# EAGLE design keyfob (EAGLE 5.11)
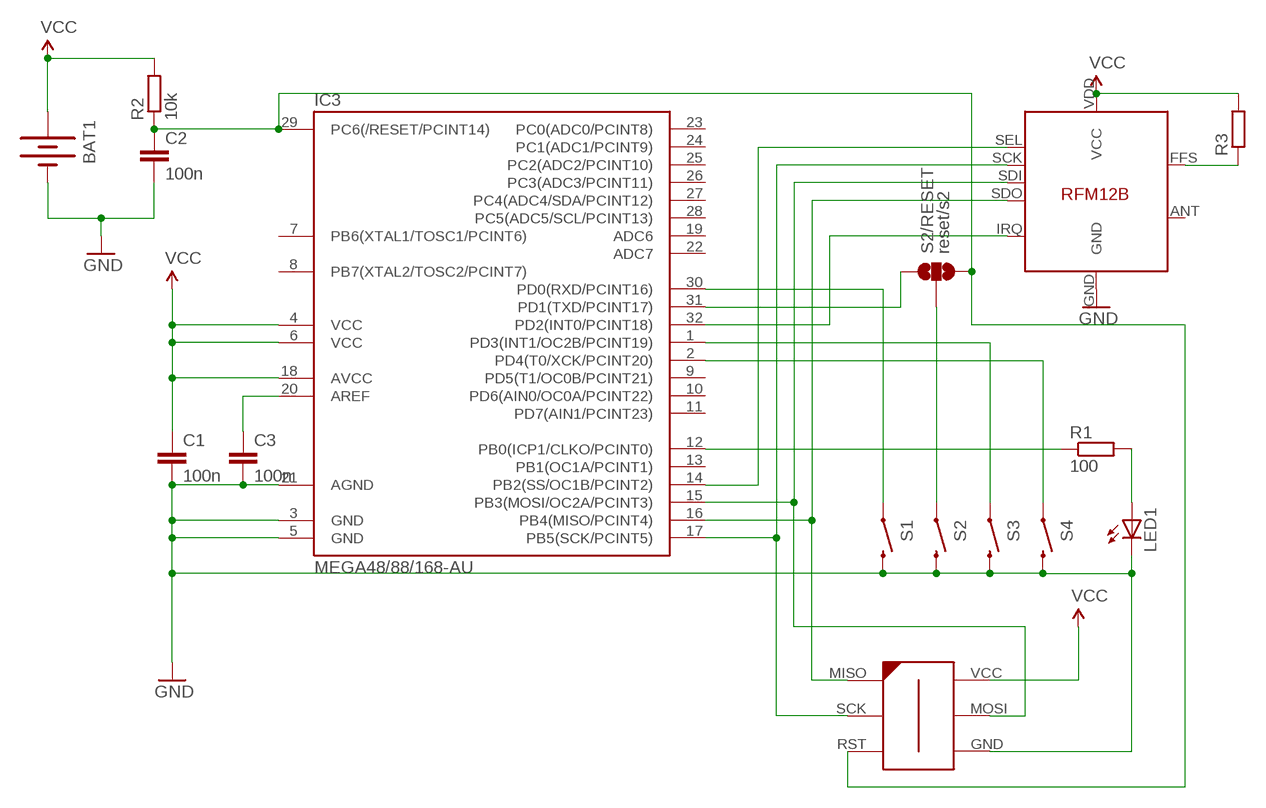
[diagram p0: schematic, sheet 1]

## Parts
BAT1  BATTERYFOB  [BATTERY_20MM_PTH_COMPACT]
C1  100n  CAP0805  [0805]
C2  100n  CAP0805  [0805]
C3  100n  CAP0805  [0805]
IC2  RFM12B  [RFM12B]
IC3  MEGA48/88/168-AU  [TQFP32-08]
LED1  LEDCHIP-LED0805  [CHIP-LED0805]
R1  100  R-EU_M0805  [M0805]
R2  10k  R-EU_M0805  [M0805]
R3  R-EU_M0805  [M0805]
S1  SWITCH-MOMENTARY-2-SMD-1101NE  [TACTILE-SWITCH-1101NE]
S2  SWITCH-MOMENTARY-2-SMD-1101NE  [TACTILE-SWITCH-1101NE]
S2/RESET  reset/s2  SOLDERJUMPER_2WAYT  [SJ_2]
S3  SWITCH-MOMENTARY-2-SMD-1101NE  [TACTILE-SWITCH-1101NE]
S4  SWITCH-MOMENTARY-2-SMD-1101NE  [TACTILE-SWITCH-1101NE]
U$1  AVR-ISP-6-EDGE  [6PAD_ISP]

## Nets
GND: BAT1.2(-) C1.2 C2.2 C3.2 IC2.GND IC3.3(GND) IC3.5(GND) IC3.21(AGND) LED1.C S1.P$2 S2.P$2 S3.P$2 S4.P$2 U$1.GND
MISO: IC2.SDO IC3.16(PB4(MISO/PCINT4)) U$1.MISO
MOSI: IC2.SDI IC3.15(PB3(MOSI/OC2A/PCINT3)) U$1.MOSI
N$1: LED1.A R1.2
N$2: S2.P$1 S2/RESET.2
N$3: C3.1 IC3.20(AREF)
N$4: IC2.IRQ IC3.32(PD2(INT0/PCINT18))
N$5: IC3.30(PD0(RXD/PCINT16)) S1.P$1
N$6: IC3.31(PD1(TXD/PCINT17)) S2/RESET.1
N$7: IC3.1(PD3(INT1/OC2B/PCINT19)) S3.P$1
N$8: IC3.2(PD4(T0/XCK/PCINT20)) S4.P$1
N$9: IC3.12(PB0(ICP1/CLKO/PCINT0)) R1.1
N$14: IC2.FFS R3.1
RESET: C2.1 IC3.29(PC6(/RESET/PCINT14)) R2.1 S2/RESET.3 U$1.RST
SCK: IC2.SCK IC3.17(PB5(SCK/PCINT5)) U$1.SCK
SEL: IC2.SEL IC3.14(PB2(SS/OC1B/PCINT2))
VCC: BAT1.1(+) C1.1 IC2.VDD(VCC) IC3.4(VCC) IC3.6(VCC) IC3.18(AVCC) R2.2 R3.2 U$1.VCC
Unconnected: IC2.ANT IC3.7(PB6(XTAL1/TOSC1/PCINT6)) IC3.8(PB7(XTAL2/TOSC2/PCINT7)) IC3.9(PD5(T1/OC0B/PCINT21)) IC3.10(PD6(AIN0/OC0A/PCINT22)) IC3.11(PD7(AIN1/PCINT23)) IC3.13(PB1(OC1A/PCINT1)) IC3.19(ADC6) IC3.22(ADC7) IC3.23(PC0(ADC0/PCINT8)) IC3.24(PC1(ADC1/PCINT9)) IC3.25(PC2(ADC2/PCINT10)) IC3.26(PC3(ADC3/PCINT11)) IC3.27(PC4(ADC4/SDA/PCINT12)) IC3.28(PC5(ADC5/SCL/PCINT13))

## Library data of the parts
BAT1 = SparkFun:BATTERY: Battery Holders Various common sizes : AA, AAA, 20mm coin cell and 12mm coin cell.
C1-C3 = SparkFun:CAP: Capacitor Standard 0603 ceramic capacitor, and 0.1" leaded capacitor.
IC2 = JeeParts:RFM12B
IC3 = avr-7:MEGA48/88/168
LED1 = led:LED: LED OSRAM: - CHIPLED LG R971, LG N971, LY N971, LG Q971, LY Q971, LO R971, LY R971 LH N974, LH R974 LS Q976, LO Q976, LY Q976 LO Q996 - Hyper CHIPLED LW Q18S LB Q993, LB Q99A, LB R99A - SideLED LS A670, LO A670, LY A670, LG A670, LP A670 LB A673, LV A673, LT A673, LW A673 LH A674 LY A675 LS A676, LA A676, LO A676, LY A676, LW A676 LS A679, LY A679, LG A679 - Hyper Micro SIDELED® LS Y876, LA Y876, LO Y876, LY Y876 LT Y87S - SmartLED LW L88C, LW L88S LB L89C, LB L89S, LG L890 LS L89K, LO L89K, LY L89K LS L896, LA L896, LO L896, LY L896 - TOPLED LS T670, LO T670, LY T670, LG T670, LP T670 LSG T670, LSP T670, LSY T670, LOP T670, LYG T670 LG T671, LOG T671, LSG T671 LB T673, LV T673, LT T673, LW T673 LH T674 LS T676, LA T676, LO T676, LY T676, LB T676, LH T676, LSB T676, LW T676 LB T67C, LV T67C, LT T67C, LS T67K, LO T67K, LY T67K, LW E67C LS E67B, LA E67B, LO E67B, LY E67B, LB E67C, LV E67C, LT E67C LW T67C LS T679, LY T679, LG T679 LS T770, LO T770, LY T770, LG T770, LP T770 LB T773, LV T773, LT T773, LW T773 LH T774 LS E675, LA E675, LY E675, LS T675 LS T776, LA T776, LO T776, LY T776, LB T776 LHGB T686 LT T68C, LB T68C - Hyper Mini TOPLED® LB M676 - Mini TOPLED Santana® LG M470 LS M47K, LO M47K, LY M47K Source: http://www.osram.convergy.de LUXEON: - LUMILED® LXK2-PW12-R00, LXK2-PW12-S00, LXK2-PW14-U00, LXK2-PW14-V00 LXK2-PM12-R00, LXK2-PM12-S00, LXK2-PM14-U00 LXK2-PE12-Q00, LXK2-PE12-R00, LXK2-PE12-S00, LXK2-PE14-T00, LXK2-PE14-U00 LXK2-PB12-K00, LXK2-PB12-L00, LXK2-PB12-M00, LXK2-PB14-N00, LXK2-PB14-P00, LXK2-PB14-Q00 LXK2-PR12-L00, LXK2-PR12-M00, LXK2-PR14-Q00, LXK2-PR14-R00 LXK2-PD12-Q00, LXK2-PD12-R00, LXK2-PD12-S00 LXK2-PH12-R00, LXK2-PH12-S00 LXK2-PL12-P00, LXK2-PL12-Q00, LXK2-PL12-R00 Source: www.luxeon.com KINGBRIGHT: KA-3528ASYC Source: www.kingbright.com
R1-R3 = rcl:R-EU_: RESISTOR, European symbol
S1-S4 = SparkFun:SWITCH-MOMENTARY-2
S2/RESET = SparkFun:SOLDERJUMPER_2WAY: Solder Jumper 2 way solder jumper
U$1 = avr-7:AVR-ISP-6-EDGE: 6 pin edge connector for ISP with ATMEL MCUs. Developed by Craig Moates (craig at moates dot net). Library by David Blundell (blundar at gmail dot com). Often, even a 6 pin header is really inconvenient for board layout and/or production. This SMD-only header is our de-facto standard for using an edge connector for programming with the help of a 6pin/10pin to edge card adapter.

## Board
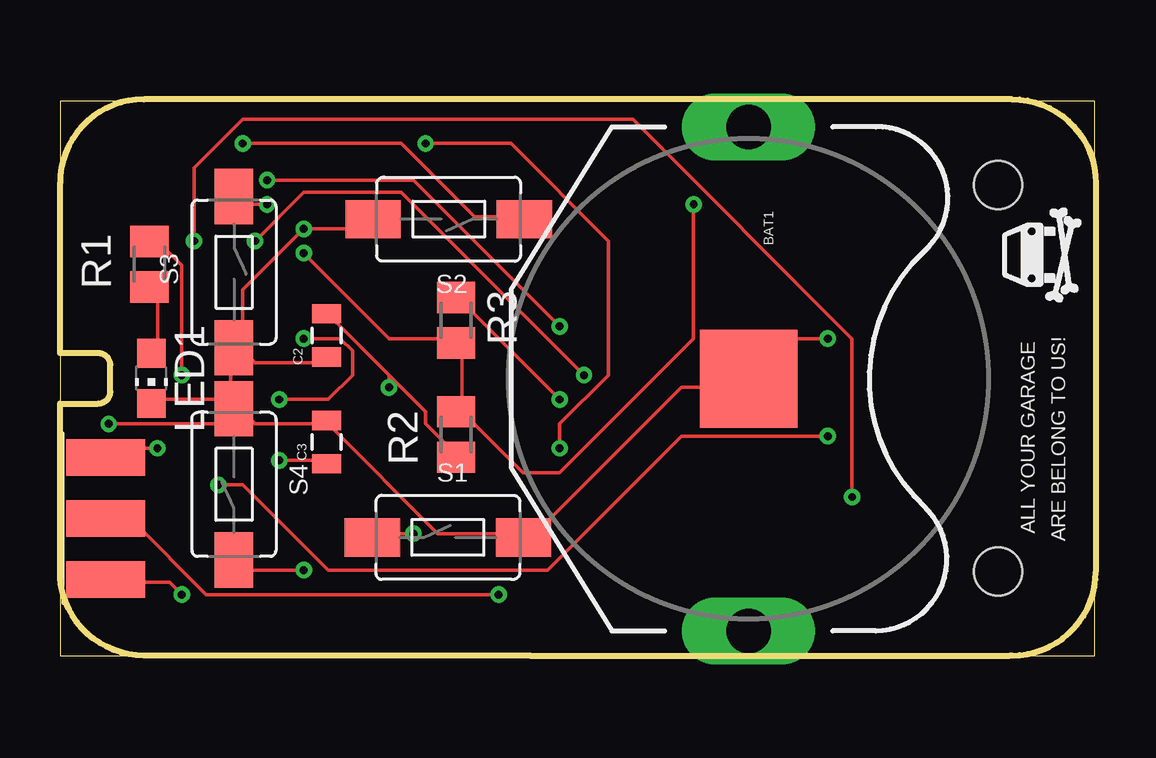
[diagram p1: board, top side]
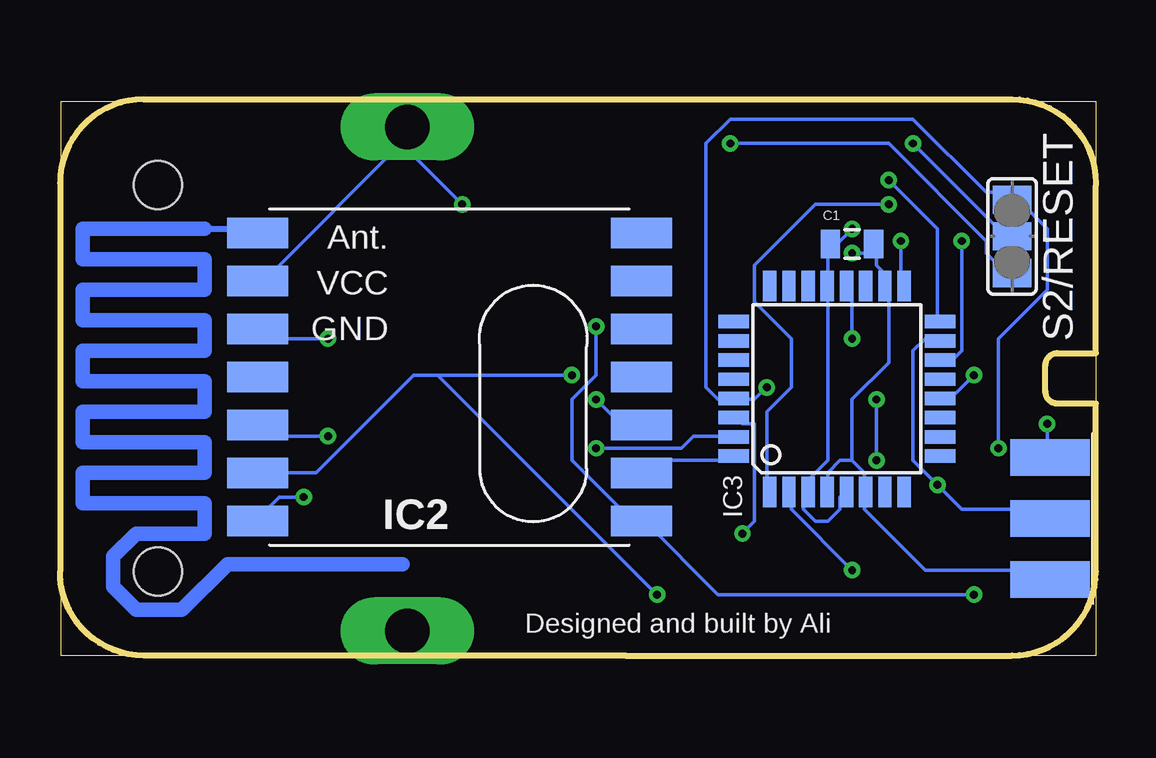
[diagram p2: board, bottom side, seen from below]

Size 43.18 x 23.18 mm. Coordinates in mm from the lower left corner, seen from the top.
Outline: 19.6,0 0,0 0,3.5
Outline: 31.11,0 39.69,0
Outline: 39.69,0 43.13,0 43.13,23.1 0,23.1 0,19.68
Outline: 0,19.68 0,19.6 0,12.6
Outline: 0,12.6 0,10.5
Outline: 31.11,0 39.6,0
Outline: 19.6,0 3.5,0 arc-90 0,3.5
Outline: 0,3.5 0,10.5
Outline: 0,10.5 1.6,10.5 arc90 2.1,11 2.1,12.1 arc90 1.6,12.6 0,12.6
Outline: 0,19.68 arc-90 3.49,23.18 39.69,23.18 arc-90 43.18,19.68 43.18,3.49 arc-90 39.69,0
Outline: 19.6,0 31.11,0
Copper layers (1*16): Top 0.0356mm / dielectric 1.5011mm / Bottom 0.0356mm
Design rules "LaenPCBOrder": minimum track width 6mil, minimum drill 13mil, track to track 6mil, track to pad 6mil, pad to pad 6mil, via to via 6mil, smd to smd 6mil, copper to edge 15mil, drill to drill 6mil, minimum pad ring 7mil, minimum via ring 7mil, stop-mask expansion 4mil, vias tented up to drill 0mil, thermal gap 10mil
Holes 2 mm at 39.1,19.6 39.1,3.5

### Footprints (pad centres in the part's own frame; a part is rotated, then mirrored left to right if it is on the bottom)
BATTERY_20MM_PTH_COMPACT = drill 1.854 long: 1 -10.5,0; 3 10.5,0 | smd 4.064 x 4.064: 2 0,0
0805 = smd 0.8 x 1.2: 1 -0.9,0; 2 0.9,0
RFM12B = smd 2.54 x 1.27: ANT 8,-6; FFS -8,2; GND 8,-2; IRQ -8,4; P$8 -8,0; P$9 -8,-2; P$10 -8,-4; P$12 -8,-6; P$16 8,0; SCK 8,4; SDI 8,2; SDO -8,6; SEL 8,6; VDD 8,-4
TQFP32-08 = smd 1.27 x 0.559: 1 -4.293,2.8; 2 -4.293,2; 3 -4.293,1.2; 4 -4.293,0.4; 5 -4.293,-0.4; 6 -4.293,-1.2; 7 -4.293,-2; 8 -4.293,-2.8; 17 4.293,-2.8; 18 4.293,-2; 19 4.293,-1.2; 20 4.293,-0.4; 21 4.293,0.4; 22 4.293,1.2; 23 4.293,2; 24 4.293,2.8 | smd 0.559 x 1.27: 9 -2.8,-4.293; 10 -2,-4.293; 11 -1.2,-4.293; 12 -0.4,-4.293; 13 0.4,-4.293; 14 1.2,-4.293; 15 2,-4.293; 16 2.8,-4.293; 25 2.8,4.293; 26 2,4.293; 27 1.2,4.293; 28 0.4,4.293; 29 -0.4,4.293; 30 -1.2,4.293; 31 -2,4.293; 32 -2.8,4.293
CHIP-LED0805 = smd 1.2 x 1.2: A 0,-1.05; C 0,1.05
M0805 = smd 1.3 x 1.6: 1 -0.95,0; 2 0.95,0
TACTILE-SWITCH-1101NE = smd 2.3 x 1.6: P$1 -3.15,0; P$2 3.15,0
SJ_2 = smd 1.168 x 1.6: 1 -1.524,0; 2 0,0; 3 1.524,0
6PAD_ISP = smd 1.524 x 3.302 bottom: GND 2.54,0; MOSI 0,0; VCC -2.54,0 | smd 1.524 x 3.302: MISO -2.54,0; RST 2.54,0; SCK 0,0

### Placement (x,y rotation side)
BAT1  28.7,11.53 270 top
C1  10.16,17.14 180 bottom
C2  11.11,13.34 270 top
C3  11.11,8.89 90 top
IC2  26.95,11.6 180 bottom
IC3  10.79,11.11 90 bottom
LED1  3.81,11.55 180 top
R1  3.72,16.3 270 top
R2  16.51,9.21 90 top
R3  16.51,13.97 270 top
S1  16.17,4.92 0 top
S2  16.2,18.18 180 top
S2/RESET  3.49,17.46 90 bottom
S3  7.25,15.98 270 top
S4  7.25,7.13 90 top
U$1  1.91,5.71 90 top

### Tracks (layer width: path | path; a pad name or v marks a point on that pad's centre or on a via)
GND  (via drill 0.33)
  Top 0.152: C2.2 10.67,12.19 8.13,12.19 7.62,12.7 S3.P$2 | S2.P$2 12.7,17.78 v10.16,17.78 7.62,15.24 7.62,13.21 S3.P$2 | v32,13.21 30.48,13.21 28.96,11.68 BAT1.2 28.45,11.18 25.91,11.18 19.81,5.08 S1.P$2 19.3,5.08 15.75,5.08 11.18,9.65 C3.2 10.67,9.65 8.13,9.65 | 8.13,9.65 7.62,10.16 S4.P$2 7.11,10.67 | 7.11,10.67 4.06,10.67 LED1.C | v2.03,9.65 8.13,9.65 | 7.11,10.67 7.11,12.7 S3.P$2
  Bottom 0.152: IC3.5 10.67,6.6 10.67,6.1 11.18,5.59 11.68,5.59 12.19,6.1 12.19,6.6 IC3.3 12.19,7.11 11.18,8.13 11.18,15.24 IC3.21 11.18,15.75 11.18,16.76 C1.2 10.67,17.27 v10.16,17.78 | v32,13.21 34.54,13.21 IC2.GND | v2.03,9.65 2.03,8.64 U$1.GND
MISO  (via drill 0.33)
  Top 0.152: v8.64,19.81 14.73,19.81 v20.83,13.72 | v5.08,2.54 4.57,3.05 2.03,3.05 U$1.MISO
  Bottom 0.152: v8.64,19.81 6.6,17.78 6.6,13.72 IC3.16 | v20.83,13.72 20.83,11.68 21.84,10.67 21.84,8.13 19.3,5.59 IC2.SDO 18.8,5.59 15.75,2.54 v5.08,2.54
MOSI  (via drill 0.33)
  Top 0.152: v32,9.14 25.91,9.14 20.32,3.56 11.18,3.56 7.62,7.11 v6.6,7.11
  Bottom 0.152: IC3.15 6.6,13.21 7.11,13.21 7.62,12.7 7.62,8.13 v6.6,7.11 5.59,6.1 2.03,6.1 U$1.MOSI | v32,9.14 34.54,9.14 IC2.SDI
N$1
  Top 0.152: LED1.A 4.06,12.7 4.06,15.24 R1.2
N$2  (via drill 0.33)
  Top 0.152: v7.62,21.34 14.22,21.34 17.27,18.29 19.3,18.29 S2.P$1
  Bottom 0.152: v7.62,21.34 4.06,17.78 3.56,17.78 S2/RESET.2
N$3  (via drill 0.33)
  Top 0.152: v9.14,8.13 10.67,8.13 C3.1 | v9.14,10.67 11.18,10.67 12.19,11.68 12.19,12.7 11.68,13.21 v10.16,13.21
  Bottom 0.152: v9.14,8.13 v9.14,10.67 | v10.16,13.21 10.16,15.24 IC3.20
N$4
  Bottom 0.152: IC3.32 15.24,8.13 18.29,8.13 18.8,7.62 IC2.IRQ
N$5  (via drill 0.33)
  Top 0.152: v14.73,5.08 13.21,5.08 S1.P$1
  Bottom 0.152: v14.73,5.08 14.22,5.59 14.22,9.65 14.73,9.65 IC3.30
N$6  (via drill 0.33)
  Top 0.152: v20.83,8.64 20.83,9.65 22.86,11.68 22.86,17.27 18.8,21.34 v15.24,21.34
  Bottom 0.152: v20.83,8.64 17.27,8.64 16.76,9.14 15.24,9.14 IC3.31 | v15.24,21.34 8.64,21.34 4.57,17.27 4.57,16.76 3.56,15.75 S2/RESET.1
N$7  (via drill 0.33)
  Top 0.152: v8.64,18.8 7.62,18.8 S3.P$1
  Bottom 0.152: v8.64,18.8 11.68,18.8 14.22,16.26 14.22,14.73 12.7,13.21 12.7,11.18 13.72,10.16 13.72,7.11 IC3.1
N$8  (via drill 0.33)
  Top 0.152: v10.16,3.56 7.62,3.56 S4.P$1
  Bottom 0.152: v10.16,3.56 12.7,6.1 12.7,6.6 IC3.2
N$9  (via drill 0.33)
  Top 0.152: v5.08,11.68 5.08,16.26 4.06,17.27 R1.1
  Bottom 0.152: v5.08,11.68 6.1,10.67 IC3.12
N$13
  Bottom 0.254: 37.15,17.78 34.92,17.78
  Bottom 0.61: 37.15,17.78 42.23,17.78 42.23,16.51 37.15,16.51 37.15,15.24 42.23,15.24 42.23,13.97 37.15,13.97 37.15,12.7 42.23,12.7 42.23,11.43 37.15,11.43 37.15,10.16 42.23,10.16 42.23,8.89 37.15,8.89 37.15,7.62 42.23,7.62 42.23,6.35 37.15,6.35 37.15,5.08 40.01,5.08 40.96,4.13 40.96,2.86 40.01,1.91 38.1,1.91 36.2,3.81 28.89,3.81
N$14  (via drill 0.33)
  Top 0.152: v20.83,10.67 16.76,14.73 R3.1
  Bottom 0.152: v20.83,10.67 19.3,9.14 IC2.FFS
RESET  (via drill 0.33)
  Top 0.152: 13.72,11.68 15.24,10.16 15.24,9.65 16.26,8.64 R2.1 | 13.72,11.68 11.18,14.22 C2.1 | v13.72,11.18 13.72,11.68 | v4.06,8.64 2.03,8.64 U$1.RST
  Bottom 0.152: v13.72,11.18 14.22,10.67 14.73,10.67 IC3.29 15.24,10.67 15.75,10.67 16.26,11.18 16.26,21.34 15.24,22.35 7.62,22.35 4.57,19.3 3.56,19.3 S2/RESET.3 3.05,18.8 2.03,17.78 2.03,15.24 4.06,13.21 v4.06,8.64
SCK  (via drill 0.33)
  Top 0.152: v8.13,17.27 10.16,19.3 14.22,19.3 v21.84,11.68 | v18.29,2.54 6.1,2.54 3.05,5.59 2.03,5.59 U$1.SCK
  Bottom 0.152: v8.13,17.27 8.13,15.75 IC3.17 | 27.43,11.68 28.45,11.68 32.51,7.62 34.54,7.62 IC2.SCK | 27.43,11.68 v21.84,11.68 | v18.29,2.54 27.43,11.68
SEL  (via drill 0.33)
  Top 0.152: v5.59,17.27 5.59,20.32 7.62,22.35 23.88,22.35 33.02,13.21 v33.02,6.6
  Bottom 0.152: v5.59,17.27 5.59,12.7 6.1,12.19 IC3.14 | v33.02,6.6 34.04,6.6 34.54,6.1 IC2.SEL
VCC  (via drill 0.33)
  Top 0.152: 16.76,10.16 16.76,12.7 R3.2 16.26,13.21 13.72,13.21 v10.16,16.76 | v26.42,18.8 26.42,13.21 20.83,7.62 19.3,7.62 16.76,10.16 | 16.76,10.16 R2.2
  Bottom 0.152: 28.96,21.34 28.45,21.84 BAT1.1 28.96,21.34 | 28.96,21.34 34.54,15.75 IC2.VDD | U$1.VCC 2.03,3.56 7.11,3.56 9.65,6.1 9.65,6.6 IC3.6 9.65,7.11 9.65,7.62 10.16,8.13 | 10.16,8.13 10.67,8.13 11.18,7.62 11.18,7.11 IC3.4 | 10.16,8.13 10.16,10.67 8.64,12.19 8.64,15.24 IC3.18 8.64,15.75 9.14,16.26 9.14,16.76 C1.1 9.65,16.76 v10.16,16.76 | v26.42,18.8 28.96,21.34

### Text on the board
tPlace: ALL YOUR GARAGE | ARE BELONG TO US!
bPlace: Designed and built by Ali